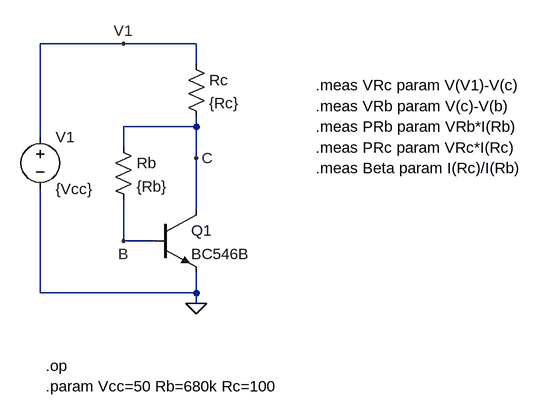
[diagram p0: schematic TBJ04a.asc]
TBJ04a.asc, the LTspice schematic file:
Version 4
SHEET 1 984 680
WIRE 256 -32 128 -32
WIRE 368 -32 256 -32
WIRE 368 0 368 -32
WIRE 368 96 368 80
WIRE 368 96 256 96
WIRE 128 112 128 -32
WIRE 256 128 256 96
WIRE 368 144 368 96
WIRE 368 224 368 144
WIRE 256 272 256 208
WIRE 304 272 256 272
WIRE 128 352 128 192
WIRE 368 352 368 320
WIRE 368 352 128 352
WIRE 368 368 368 352
FLAG 368 368 0
FLAG 256 272 B
FLAG 368 144 C
FLAG 256 -32 V1
SYMBOL voltage 128 96 R0
WINDOW 123 0 0 Left 0
WINDOW 39 0 0 Left 0
SYMATTR InstName V1
SYMATTR Value {Vcc}
SYMBOL res 240 112 R0
SYMATTR InstName Rb
SYMATTR Value {Rb}
SYMBOL res 352 -16 R0
SYMATTR InstName Rc
SYMATTR Value {Rc}
SYMBOL npn 304 224 R0
SYMATTR InstName Q1
SYMATTR Value BC546B
TEXT 136 464 Left 2 !.op
TEXT 136 496 Left 2 !.param Vcc=50 Rb=680k Rc=100
TEXT 552 32 Left 2 !.meas VRc param V(V1)-V(c)
TEXT 552 64 Left 2 !.meas VRb param V(c)-V(b)
TEXT 552 96 Left 2 !.meas PRb param VRb*I(Rb)
TEXT 552 128 Left 2 !.meas PRc param VRc*I(Rc)
TEXT 552 160 Left 2 !.meas Beta param I(Rc)/I(Rb)

The netlist it stands for:
* TBJ04a.asc
V1 V1 0 {Vcc}
Rb C B {Rb}
Rc V1 C {Rc}
Q1 C B 0 0 BC546B
.model NPN NPN
.model PNP PNP
.lib standard.bjt
.op
.param Vcc=50 Rb=680k Rc=100
.meas VRc param V(V1)-V(c)
.meas VRb param V(c)-V(b)
.meas PRb param VRb*I(Rb)
.meas PRc param VRc*I(Rc)
.meas Beta param I(Rc)/I(Rb)
.backanno
.end